# EAGLE design LED-mini20-SHIM (EAGLE 9.6.2)
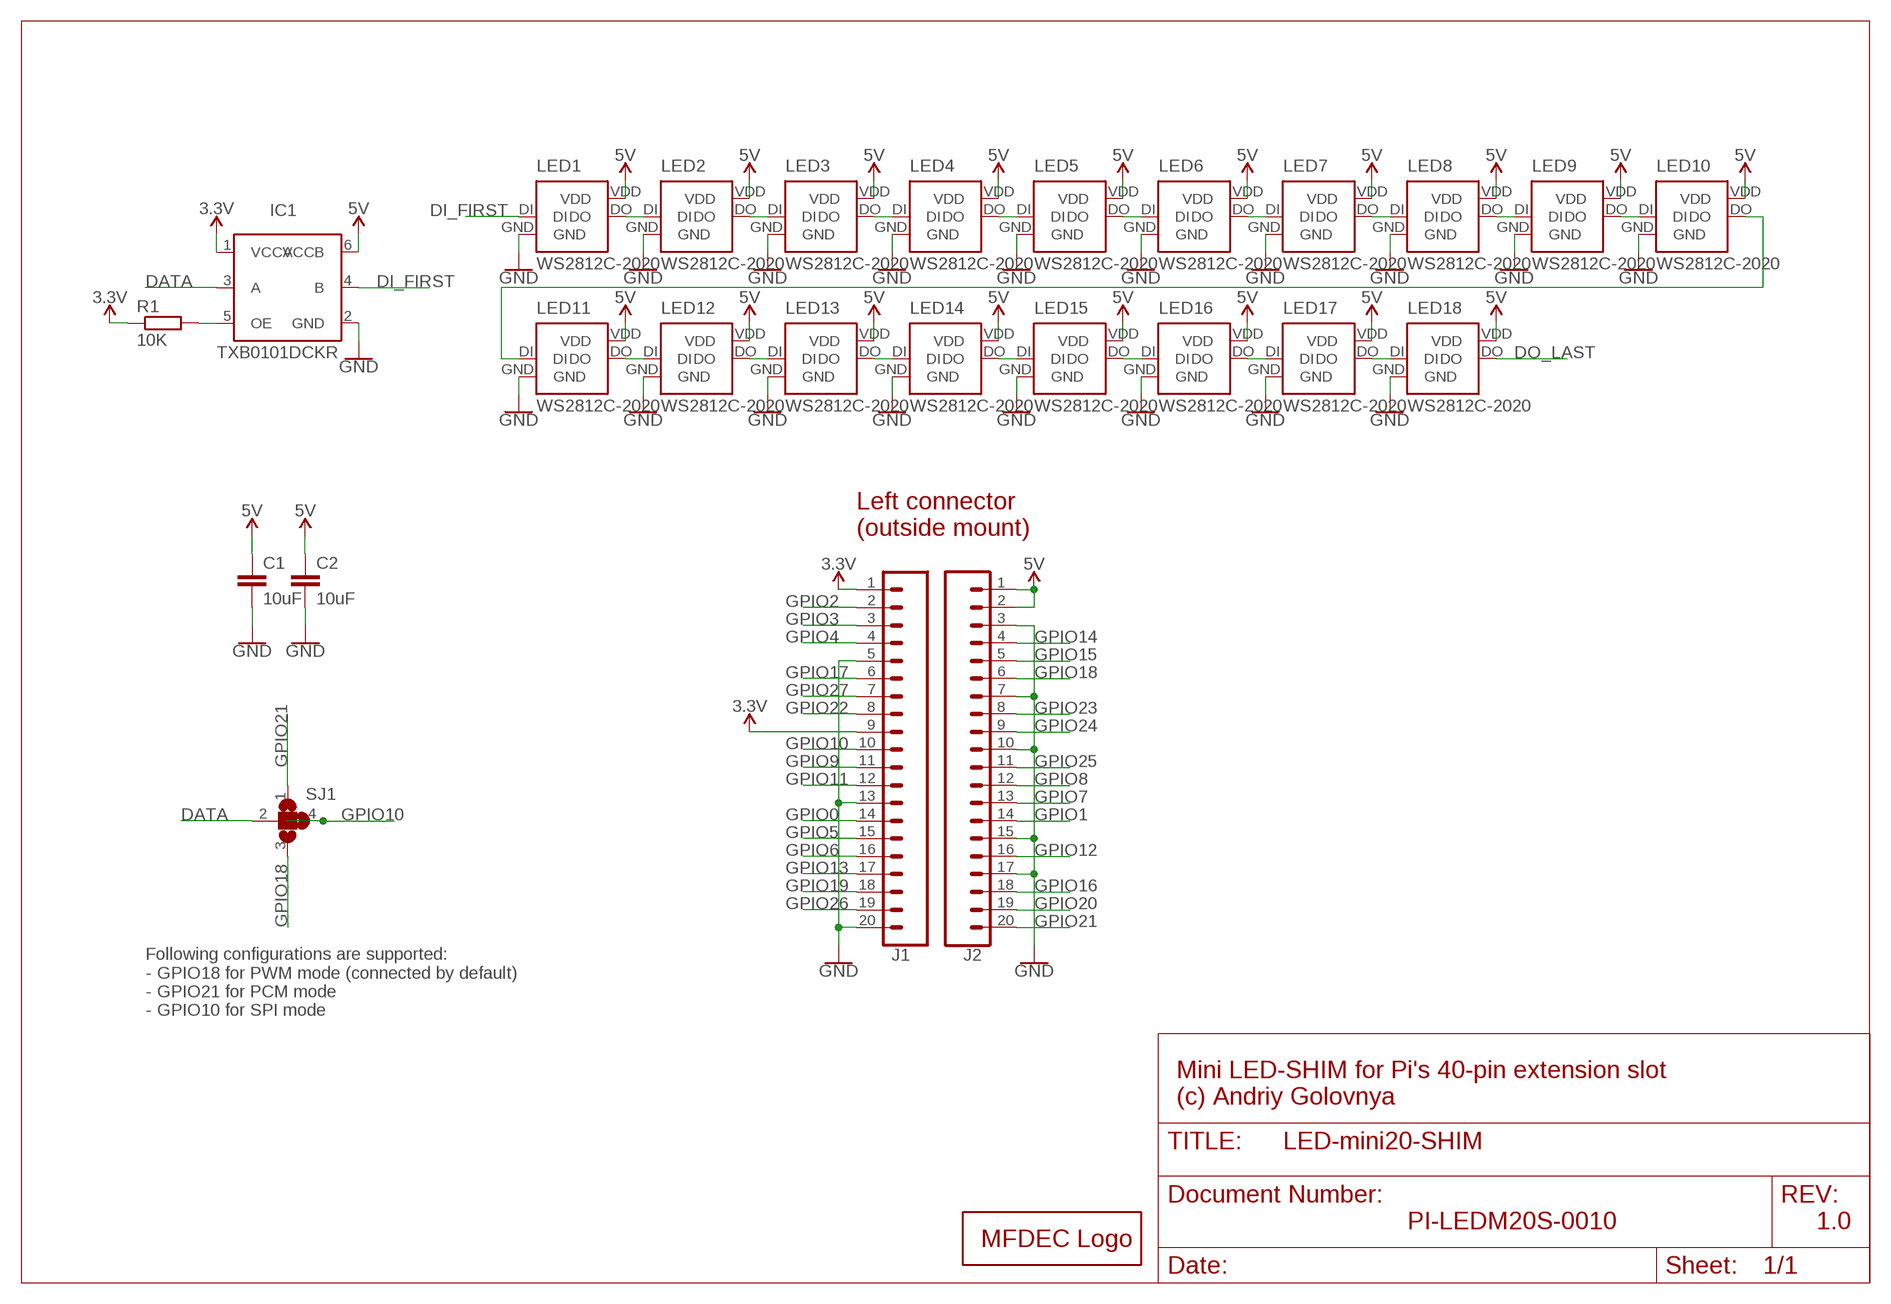
[diagram p0: schematic, sheet 1]

## Parts
C1  10uF  C-EUC0805  [C0805]
C2  10uF  C-EUC0805  [C0805]
IC1  TXB0101DCKR  [SOT65P210X110-6N]
J1  CONN_20LOCK  [1X20_LOCK]
J2  CONN_20LOCK  [1X20_LOCK]
LED1  WS2812C-2020  [WS2812X-2020]
LED2  WS2812C-2020  [WS2812X-2020]
LED3  WS2812C-2020  [WS2812X-2020]
LED4  WS2812C-2020  [WS2812X-2020]
LED5  WS2812C-2020  [WS2812X-2020]
LED6  WS2812C-2020  [WS2812X-2020]
LED7  WS2812C-2020  [WS2812X-2020]
LED8  WS2812C-2020  [WS2812X-2020]
LED9  WS2812C-2020  [WS2812X-2020]
LED10  WS2812C-2020  [WS2812X-2020]
LED11  WS2812C-2020  [WS2812X-2020]
LED12  WS2812C-2020  [WS2812X-2020]
LED13  WS2812C-2020  [WS2812X-2020]
LED14  WS2812C-2020  [WS2812X-2020]
LED15  WS2812C-2020  [WS2812X-2020]
LED16  WS2812C-2020  [WS2812X-2020]
LED17  WS2812C-2020  [WS2812X-2020]
LED18  WS2812C-2020  [WS2812X-2020]
LOGO1  MFDECLOGO_L_10MM  [MFDEC_L_10MM]
R1  10K  R-EU_R0402  [R0402]
SJ1  SJ3  [SJ_3]

## Nets
3.3V: IC1.1(VCCA) J1.1 J1.9 R1.1
5V: C1.1 C2.1 IC1.6(VCCB) J2.1 J2.2 LED1.VDD LED2.VDD LED3.VDD LED4.VDD LED5.VDD LED6.VDD LED7.VDD LED8.VDD LED9.VDD LED10.VDD LED11.VDD LED12.VDD LED13.VDD LED14.VDD LED15.VDD LED16.VDD LED17.VDD LED18.VDD
DATA: IC1.3(A) SJ1.2
DI_FIRST: IC1.4(B) LED1.DI
DO_LAST: LED18.DO
GND: C1.2 C2.2 IC1.2(GND) J1.5 J1.13 J1.20 J2.3 J2.7 J2.10 J2.15 J2.17 LED1.GND LED2.GND LED3.GND LED4.GND LED5.GND LED6.GND LED7.GND LED8.GND LED9.GND LED10.GND LED11.GND LED12.GND LED13.GND LED14.GND LED15.GND LED16.GND LED17.GND LED18.GND
GPIO0: J1.14
GPIO1: J2.14
GPIO2: J1.2
GPIO3: J1.3
GPIO4: J1.4
GPIO5: J1.15
GPIO6: J1.16
GPIO7: J2.13
GPIO8: J2.12
GPIO9: J1.11
GPIO10: J1.10 SJ1.4
GPIO11: J1.12
GPIO12: J2.16
GPIO13: J1.17
GPIO14: J2.4
GPIO15: J2.5
GPIO16: J2.18
GPIO17: J1.6
GPIO18: J2.6 SJ1.3
GPIO19: J1.18
GPIO20: J2.19
GPIO21: J2.20 SJ1.1
GPIO22: J1.8
GPIO23: J2.8
GPIO24: J2.9
GPIO25: J2.11
GPIO26: J1.19
GPIO27: J1.7
N$1: LED1.DO LED2.DI
N$2: LED2.DO LED3.DI
N$3: LED3.DO LED4.DI
N$4: LED4.DO LED5.DI
N$5: LED5.DO LED6.DI
N$6: LED6.DO LED7.DI
N$7: LED7.DO LED8.DI
N$8: LED8.DO LED9.DI
N$9: LED9.DO LED10.DI
N$10: LED10.DO LED11.DI
N$11: LED11.DO LED12.DI
N$12: LED12.DO LED13.DI
N$13: LED13.DO LED14.DI
N$14: LED14.DO LED15.DI
N$15: LED15.DO LED16.DI
N$16: LED16.DO LED17.DI
N$17: LED17.DO LED18.DI
N$143: IC1.5(OE) R1.2

## Notes on the sheet
- Left connector
  (outside mount)
- Following configurations are supported:
  - GPIO18 for PWM mode (connected by default)
  - GPIO21 for PCM mode
  - GPIO10 for SPI mode
- Mini LED-SHIM for Pi's 40-pin extension slot
  (c) Andriy Golovnya
- PI-LEDM20S-0010 | 1.0

## Library data of the parts
C1 C2 = rcl:C-EU: CAPACITOR, European symbol; SPICEPREFIX: C
IC1 = TXB0101DCKR:TXB0101DCKR
J1 J2 = _my_locked_connectors:CONN_20: Multi connection point. Often used as Generic Header-pin footprint for 0.1 inch spaced/style header connections On any of the 0.1 inch spaced packages, you can populate with these: Break Away Headers - Straight <https://www.sparkfun.com/products/116> (PRT-00116) Break Away Male Headers - Right Angle <https://www.sparkfun.com/products/553> (PRT-00553) Female Headers <https://www.sparkfun.com/products/115> (PRT-00115) Break Away Headers - Machine Pin <https://www.sparkfun.com/products/117> (PRT-00117) Break Away Female Headers - Swiss Machine Pin <https://www.sparkfun.com/products/743> (PRT-00743) For SCREWTERMINALS and SPRING TERMINALS visit here: Screw Terimnals on SparkFun.com <https://www.sparkfun.com/search/results?term=Screw+Terminals> (5mm/3.5mm/2.54mm spacing) This device is also useful as a general connection point to wire up your design to another part of your project. Our various solder wires solder well into these plated through hole pads. Hook-Up Wire - Assortment (Stranded, 22 AWG) <https://www.sparkfun.com/products/11375> (PRT-11375) Hook-Up Wire - Assortment (Solid Core, 22 AWG) <https://www.sparkfun.com/products/11367> (PRT-11367) View the entire wire category on our website here <https://www.sparkfun.com/categories/141> Special notes: Molex polarized connector foot print use with SKU : PRT-08231 with associated crimp pins and housings. 1MM SMD Version SKU: PRT-10208 NOTES ON THE VARIANTS LOCK and LOCK_LONGPADS... This footprint was designed to help hold the alignment of a through-hole component (i.e. 6-pin header) while soldering it into place. You may notice that each hole has been shifted either up or down by 0.005 of an inch from it's more standard position (which is a perfectly straight line). This slight alteration caused the pins (the squares in the middle) to touch the edges of the holes. Because they are alternating, it causes a "brace" to hold the component in place. 0.005 has proven to be the perfect amount of "off-center" position when using our standard breakaway headers. Although looks a little odd when you look at the bare footprint, once you have a header in there, the alteration is very hard to notice. Also,if you push a header all the way into place, it is covered up entirely on the bottom side. Note about LOCK SPECIAL package: This is just like the LOCK variant in that the holes are staggared by 5 mil, but except for the last two holes. They are not altered from the "standard" footprint layout. This is used for a special purpose on the layout of our Graphic LCD Backpack. Make sure you want to use this device before selecting it for you project!
LED1-LED18 = WS281X:WS2812: WS2812 RGB LED
LOGO1 = _my_logos:MFDECLOGO: Midnight Fog - Digital Eye Candy LOGO
R1 = rcl:R-EU_: RESISTOR, European symbol; SPICEPREFIX: R
SJ1 = _my_jumpers:SJ3: SMD solder JUMPER SJ3 - simple jumper SJ3FI - fancy inside jumper SJ3FO - fancy outside jumper SJ3W - wide jumper

## Board
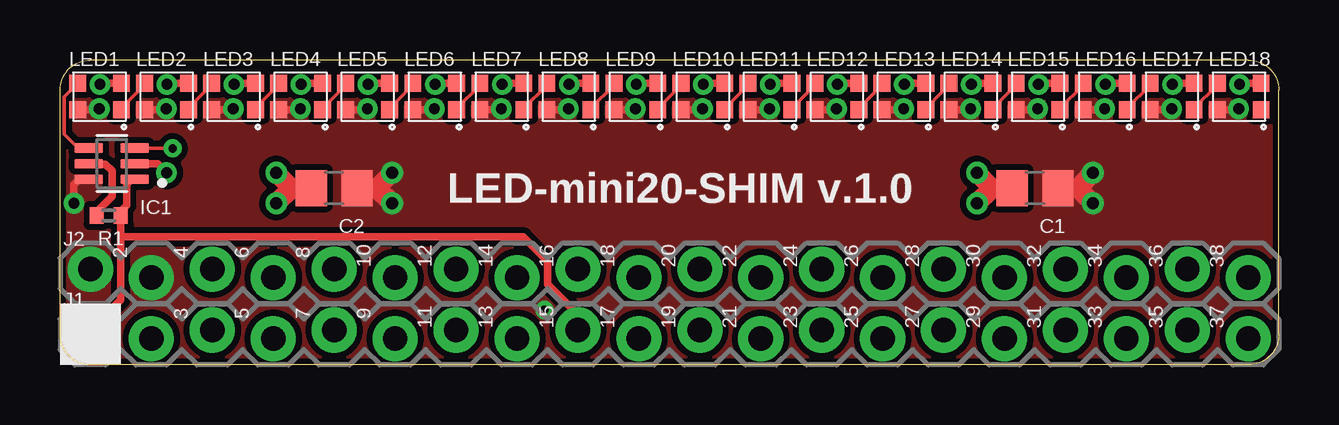
[diagram p1: board, top side]
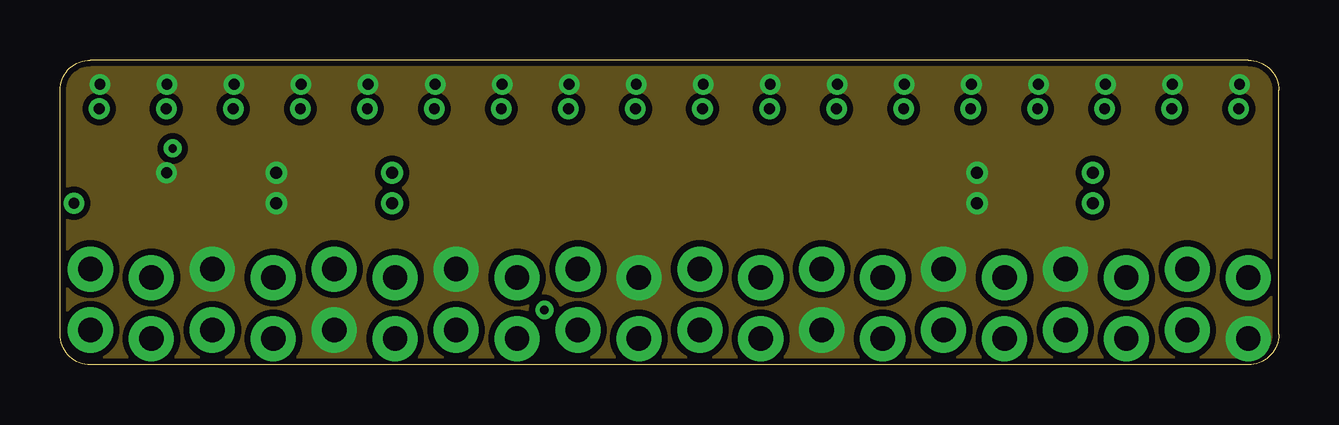
[diagram p2: board, inner layer Route2]
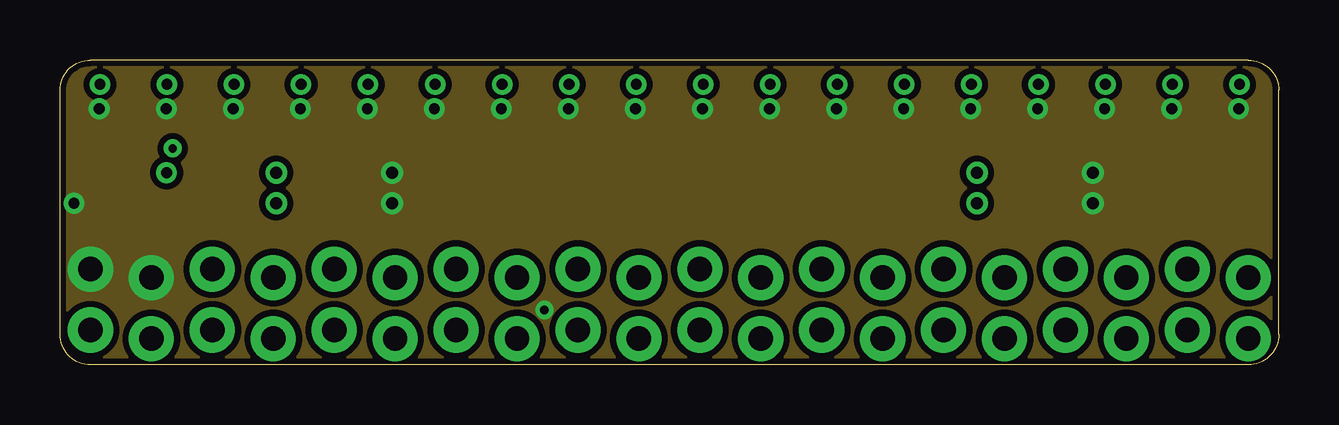
[diagram p3: board, inner layer Route15]
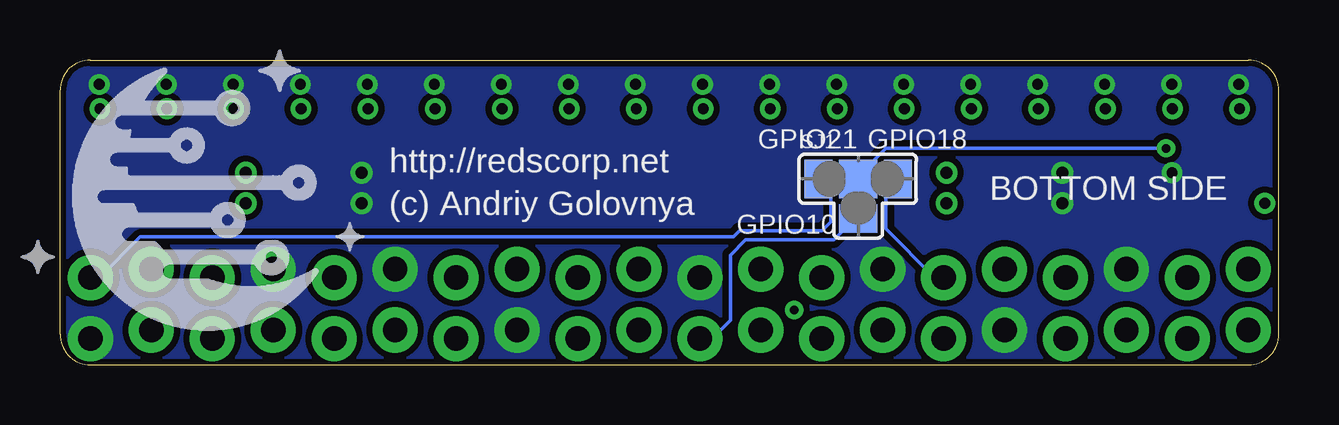
[diagram p4: board, bottom side, seen from below]

Size 50.8 x 12.7 mm. Coordinates in mm from the lower left corner, seen from the top.
Outline: 50.8,1.27 50.8,11.43 arc90 49.53,12.7 1.27,12.7 arc90 0,11.43 0,1.27 arc90 1.27,0 49.53,0 arc90 50.8,1.27
Copper layers (1+2*15+16): Top 0.035mm / dielectric 0.2mm / Route2 0.035mm / dielectric 1.5mm / Route15 0.035mm / dielectric 0.2mm / Bottom 0.035mm
Design rules "default *": minimum track width 6mil, minimum drill 0.35mm, track to track 6mil, track to pad 6mil, pad to pad 6mil, via to via 6mil, smd to smd 6mil, copper to edge 6mil, drill to drill 6mil, minimum pad ring 10mil, minimum via ring 8mil, stop-mask expansion 4mil, vias tented up to drill 20mil, thermal gap 10mil

### Footprints (pad centres in the part's own frame; a part is rotated, then mirrored left to right if it is on the bottom)
C0805 = smd 1.3 x 1.5: 1 -0.95,0; 2 0.95,0
SOT65P210X110-6N = smd 1.19 x 0.4: 1 -0.96,0.65; 2 -0.96,0; 3 -0.96,-0.65; 4 0.96,-0.65; 5 0.96,0; 6 0.96,0.65
1X20_LOCK = drill 1.016 pad 1.88: 1 0,0.178; 2 2.54,-0.178; 3 5.08,0.178; 4 7.62,-0.178; 5 10.16,0.178; 6 12.7,-0.178; 7 15.24,0.178; 8 17.78,-0.178; 9 20.32,0.178; 10 22.86,-0.178; 11 25.4,0.178; 12 27.94,-0.178; 13 30.48,0.178; 14 33.02,-0.178; 15 35.56,0.178; 16 38.1,-0.178; 17 40.64,0.178; 18 43.18,-0.178; 19 45.72,0.178; 20 48.26,-0.178
WS2812X-2020 = smd 0.7 x 0.7: DI -0.915,0.55; DO 0.915,-0.55; GND 0.915,0.55; VDD -0.915,-0.55
R0402 = smd 0.6 x 0.7: 1 -0.5,0; 2 0.5,0
SJ_3 = smd 1.168 x 1.6: 1 -1.651,0; 3 1.651,0 | smd 1.6 x 1.6: 2 0,0 | smd 1.6 x 1.168: 4 0,-1.651

### Placement (x,y rotation side)
C1  40.64,7.37 180 top
C2  11.43,7.37 180 top
IC1  2.16,8.38 180 top
J1  1.27,1.27 0 top
J2  1.27,3.81 0 top
LED1  1.65,11.18 0 top
LED2  4.45,11.18 0 top
LED3  7.24,11.18 0 top
LED4  10.03,11.18 0 top
LED5  12.83,11.18 0 top
LED6  15.62,11.18 0 top
LED7  18.41,11.18 0 top
LED8  21.21,11.18 0 top
LED9  24,11.18 0 top
LED10  26.8,11.18 0 top
LED11  29.59,11.18 0 top
LED12  32.38,11.18 0 top
LED13  35.18,11.18 0 top
LED14  37.97,11.18 0 top
LED15  40.77,11.18 0 top
LED16  43.56,11.18 0 top
LED17  46.35,11.18 0 top
LED18  49.15,11.18 0 top
LOGO1  53.21,0.51 0 bottom
R1  2.03,6.22 180 top
SJ1  17.53,7.75 0 bottom

### Tracks (layer width: path | path; a pad name or v marks a point on that pad's centre or on a via)
3.3V
  Top 0.305: J1.1 2.54,2.72 2.54,5.33 | 2.54,5.33 R1.1 2.53,6.4 2.79,6.66 2.79,7.53 2.99,7.73 IC1.1 | J1.9 21.59,2.08 20.32,3.35 20.32,4.32 19.3,5.33 2.54,5.33
5V  (via drill 0.35, 0.45, 0.5)
  Top 0.305: LED1.VDD 1.59,10.63 v1.64,10.67 | LED2.VDD 4.39,10.63 v4.43,10.67 | LED3.VDD 7.18,10.63 v7.22,10.67 | LED4.VDD 9.97,10.63 v10.02,10.67 | LED5.VDD 12.77,10.63 v12.81,10.67 | LED6.VDD 15.56,10.63 v15.61,10.67 | LED7.VDD 18.36,10.63 v18.4,10.67 | LED8.VDD 21.15,10.63 v21.19,10.67 | LED9.VDD 23.95,10.63 v23.99,10.67 | LED10.VDD 26.74,10.63 v26.78,10.67 | LED11.VDD 29.53,10.63 v29.57,10.67 | LED12.VDD 32.33,10.63 v32.37,10.67 | LED13.VDD 35.12,10.63 v35.16,10.67 | LED14.VDD 37.91,10.63 v37.96,10.67 | LED15.VDD 40.71,10.63 v40.75,10.67 | LED16.VDD 43.5,10.63 v43.55,10.67 | LED17.VDD 46.3,10.63 v46.34,10.67 | LED18.VDD 49.09,10.63 v49.13,10.67 | v0.58,6.73 0.58,7.49 0.82,7.73 IC1.6
  Top 0.813: 13.21,7.37 v13.84,6.73 | C2.1 13.21,7.37 | 13.21,7.37 v13.84,8 | 42.42,7.37 v43.05,6.73 | C1.1 42.42,7.37 | 42.42,7.37 v43.05,8
  other vias: 20.19,2.29
  pour Top (isolate 0.254, no thermals): -3.81,0 -3.81,12.7 50.8,12.7 50.8,0
  pour Route15 (isolate 0.254, no thermals): 0,-3.81 0,12.7 50.8,12.7 50.8,-3.81
DATA  (via drill 0.35)
  Top 0.152: IC1.3 4.68,9.03 v4.7,9.02
  Bottom 0.152: v4.7,9.02 16.38,9.02 17.53,7.87 SJ1.2
DI_FIRST
  Top 0.152: LED1.DI 0.18,11.17 0.18,9.6 0.76,9.02 1.18,9.02 IC1.4
GND  (via drill 0.45, 0.5)
  Top 0.305: LED1.GND 1.71,11.73 v1.67,11.68 | LED2.GND 4.5,11.73 v4.46,11.68 | LED3.GND 7.3,11.73 v7.25,11.68 | LED4.GND 10.09,11.73 v10.05,11.68 | LED5.GND 12.88,11.73 v12.84,11.68 | LED6.GND 15.68,11.73 v15.64,11.68 | LED7.GND 18.47,11.73 v18.43,11.68 | LED8.GND 21.27,11.73 v21.23,11.68 | LED9.GND 24.06,11.73 v24.02,11.68 | LED10.GND 26.86,11.73 v26.81,11.68 | LED11.GND 29.65,11.73 v29.61,11.68 | LED12.GND 32.44,11.73 v32.4,11.68 | LED13.GND 35.24,11.73 v35.2,11.68 | LED14.GND 38.03,11.73 v37.99,11.68 | LED15.GND 40.83,11.73 v40.78,11.68 | LED16.GND 43.62,11.73 v43.58,11.68 | LED17.GND 46.41,11.73 v46.37,11.68 | LED18.GND 49.21,11.73 v49.16,11.68 | v4.45,8 4.06,8.38 IC1.2
  Top 0.813: 9.65,7.37 v9.02,8 | C2.2 9.65,7.37 | 9.65,7.37 v9.02,6.73 | 38.86,7.37 v38.23,8 | C1.2 38.86,7.37 | 38.86,7.37 v38.23,6.73
  pour Bottom (isolate 0.254, no thermals): 0,0 0,12.7 54.61,12.7 54.61,0
  pour Route2 (isolate 0.254, no thermals): 0,0 0,16.51 50.8,16.51 50.8,0
GPIO10
  Bottom 0.152: J1.10 23.62,1.09 22.86,1.85 22.86,4.57 22.23,5.21 18.54,5.21 17.65,6.1 SJ1.4
GPIO18
  Bottom 0.152: J2.6 14.35,3.63 16.38,5.66 16.38,7.24 SJ1.3 17.13,7.75
GPIO21
  Bottom 0.152: SJ1.1 19.18,7.62 18.67,7.11 18.67,5.97 19.05,5.59 22.48,5.59 22.73,5.33 47.45,5.33 49.15,3.63 J2.20
N$1
  Top 0.152: LED2.DI 3.53,11.67 2.57,10.7 LED1.DO
N$2
  Top 0.152: LED3.DI 6.32,11.67 5.36,10.7 LED2.DO
N$3
  Top 0.152: LED4.DI 9.12,11.67 8.15,10.7 LED3.DO
N$4
  Top 0.152: LED4.DO 10.95,10.69 11.91,11.65 LED5.DI
N$5
  Top 0.152: LED5.DO 13.74,10.69 14.71,11.65 LED6.DI
N$6
  Top 0.152: LED6.DO 16.54,10.69 17.5,11.65 LED7.DI
N$7
  Top 0.152: LED7.DO 19.33,10.69 20.29,11.65 LED8.DI
N$8
  Top 0.152: LED8.DO 22.12,10.69 23.09,11.65 LED9.DI
N$9
  Top 0.152: LED9.DO 24.92,10.69 25.88,11.65 LED10.DI
N$10
  Top 0.152: LED10.DO 27.71,10.69 28.68,11.65 LED11.DI
N$11
  Top 0.152: LED11.DO 30.51,10.69 31.47,11.65 LED12.DI
N$12
  Top 0.152: LED12.DO 33.3,10.69 34.26,11.65 LED13.DI
N$13
  Top 0.152: LED13.DO 36.09,10.69 37.06,11.65 LED14.DI
N$14
  Top 0.152: LED14.DO 38.89,10.69 39.85,11.65 LED15.DI
N$15
  Top 0.152: LED15.DO 41.68,10.69 42.65,11.65 LED16.DI
N$16
  Top 0.152: LED16.DO 44.48,10.69 45.44,11.65 LED17.DI
N$17
  Top 0.152: LED17.DO 47.27,10.69 48.23,11.65 LED18.DI
N$143
  Top 0.305: IC1.5 1.22,8.36 1.89,8.36 2.17,8.08 2.17,7.02 1.53,6.38 R1.2

### Text on the board
tPlace: LED-mini20-SHIM v.1.0 | 2 | 4 | 6 | 8 | 10 | 12 | 14 | 16 | 18 | 20 | 22 | 24 | 26 | 28 | 30 | 32 | 34 | 36 | 38 | 3 | 5 | 7 | 9 | 11 | 13 | 15 | 17 | 19 | 21 | 23 | 25 | 27 | 29 | 31 | 33 | 35 | 37
bPlace: GPIO18 | GPIO21 | http://redscorp.net | BOTTOM SIDE | (c) Andriy Golovnya | GPIO10